# Altium schematic sheet Connectors.SchDoc
size C; DrawnBy: Ross Harvey; Engineer: Ross Harvey; Revision: A; SheetNumber: 6; SheetTotal: 7
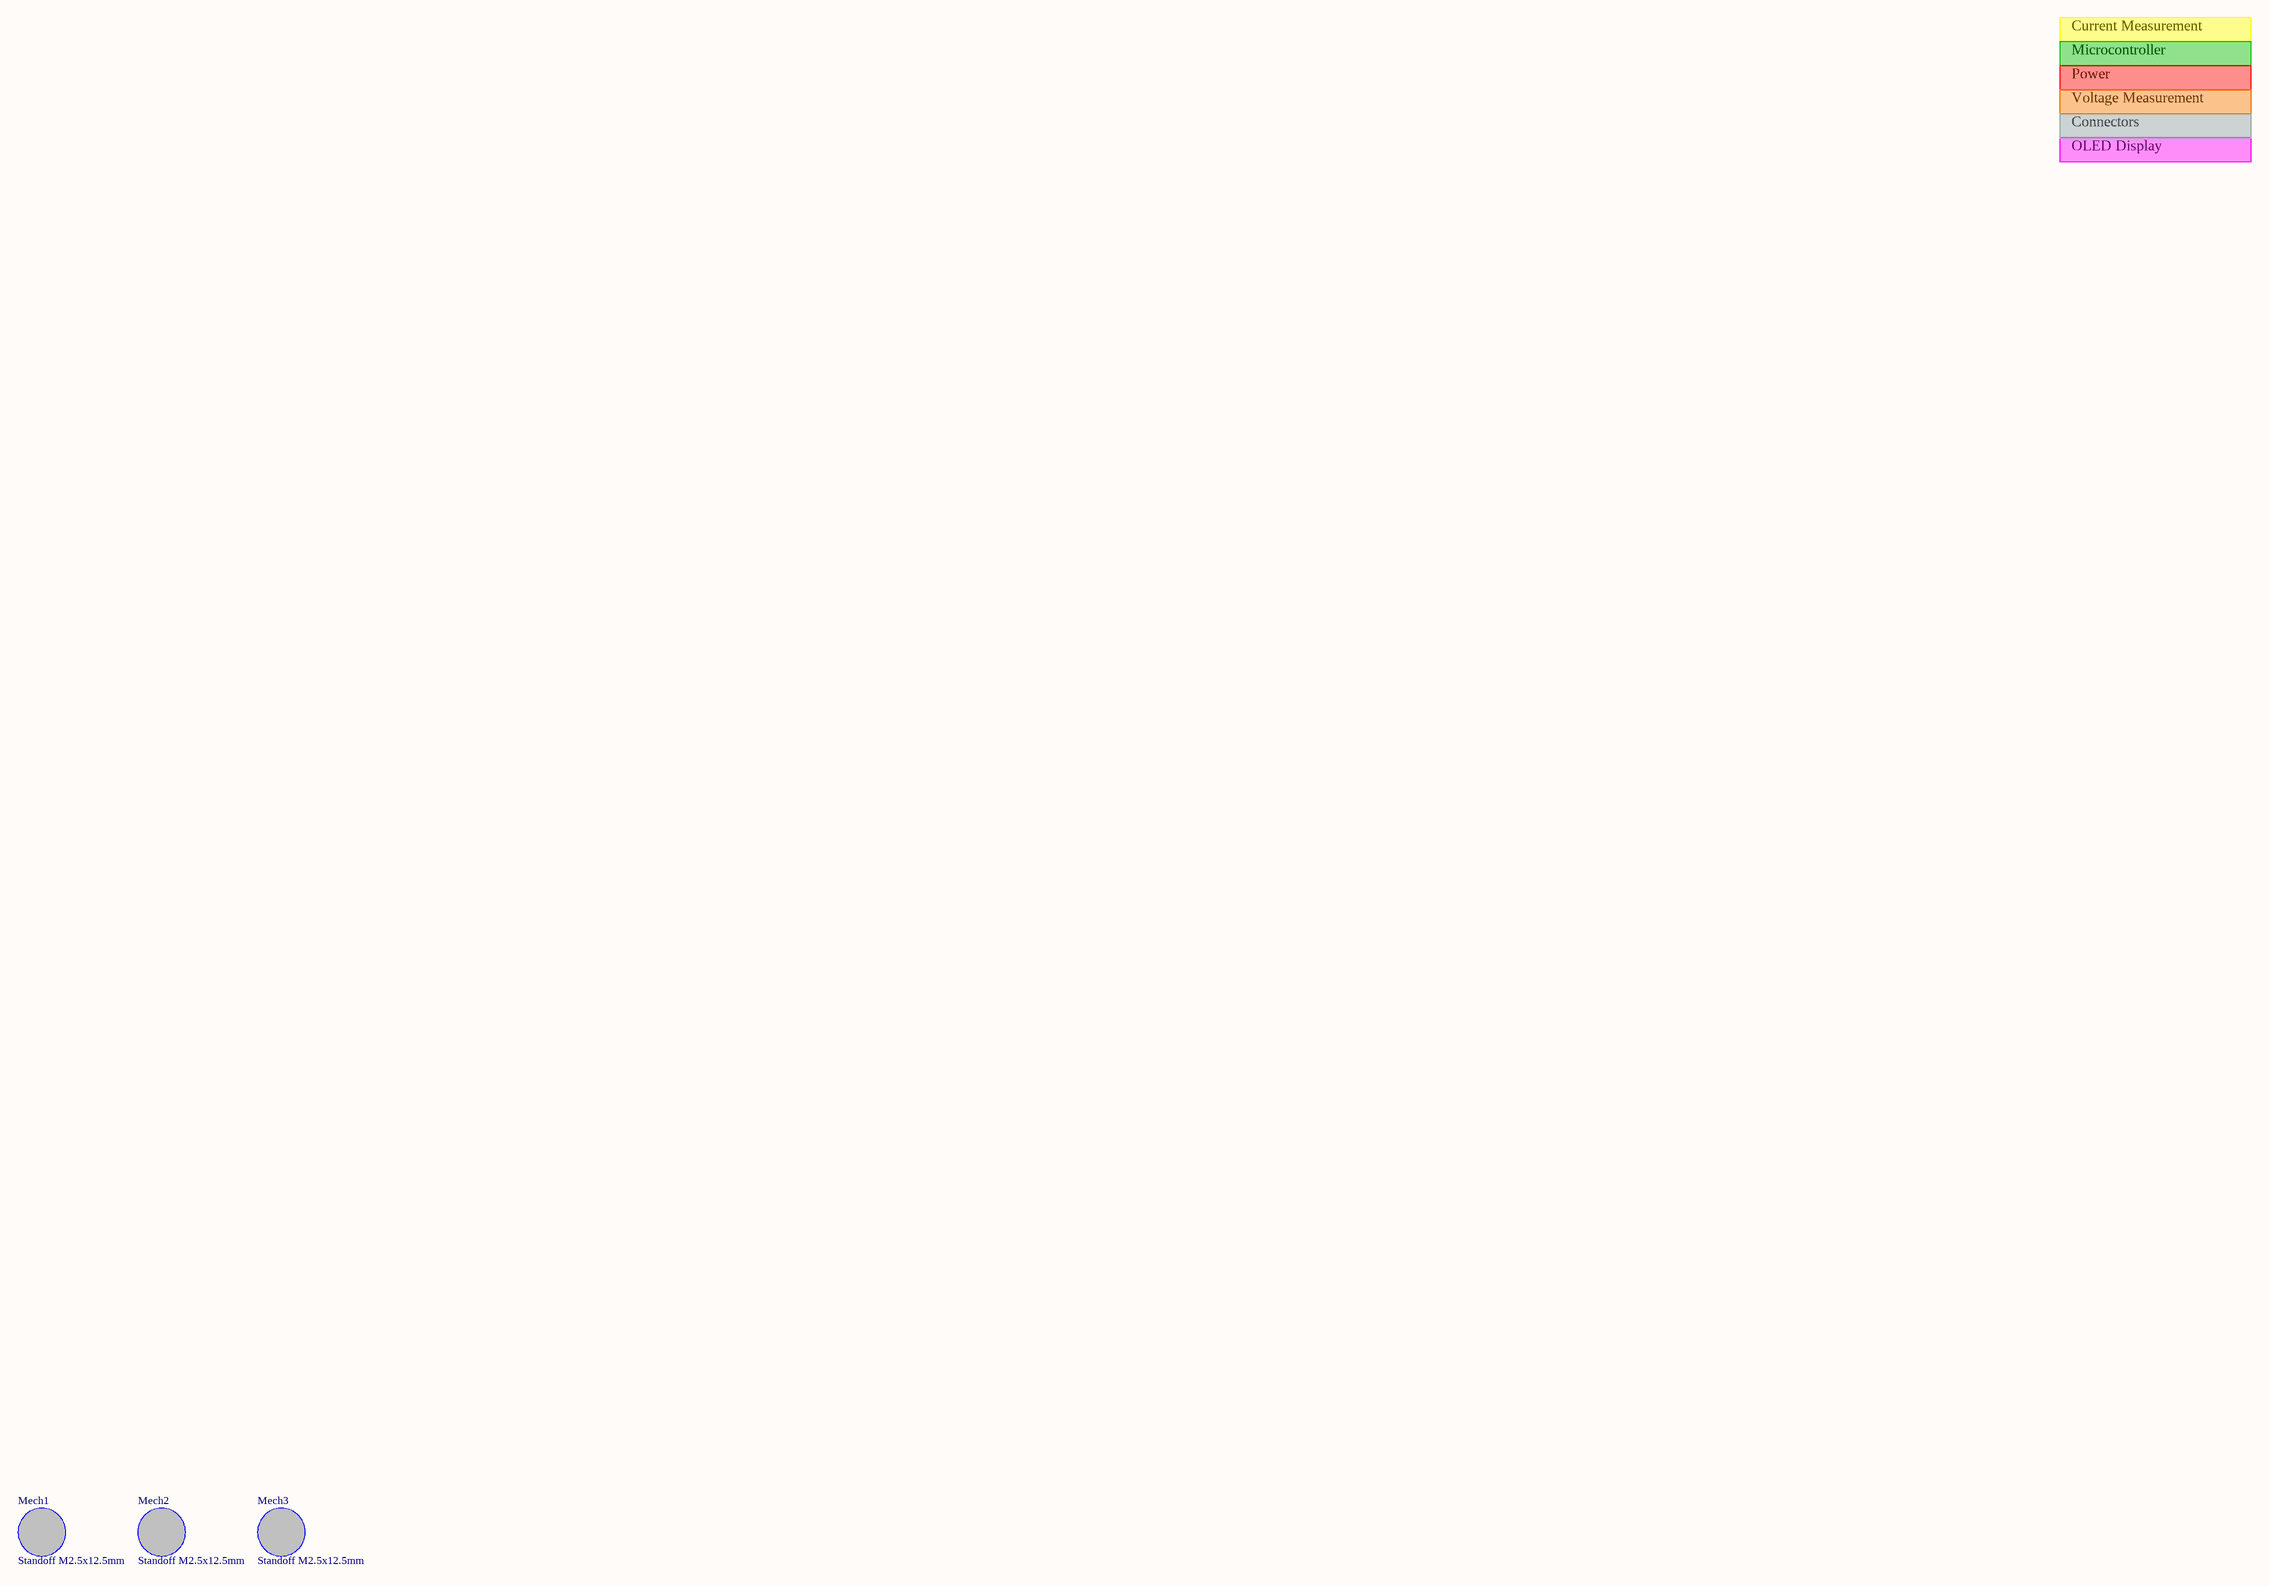
[diagram p0: Connectors.SchDoc]

## Parts
Mech1  Standoff M2.5x12.5mm  [Standoff M2.5x12mm]
Mech2  Standoff M2.5x12.5mm  [Standoff M2.5x12mm]
Mech3  Standoff M2.5x12.5mm  [Standoff M2.5x12mm]

## Nets

Not connected (* = marked no-connect by the designer): Mech1 1; Mech2 1; Mech3 1

## Notes on the sheet
- Current Measurement
- Microcontroller
- Power
- Voltage Measurement
- Connectors
- OLED Display

## Library data of the parts
Mech1-Mech3 = Standoff M2.5x12.5mm: MFG: KEYSTONE; MFG_PN: 24284